# EAGLE design Project_PCB (EAGLE 9.6.2)
AUTHOR: Dunn, Frabosilio, Lee; BOARD_NAME: Satellite Platform Schematic; PROJECT_NAME: ME 507 Project
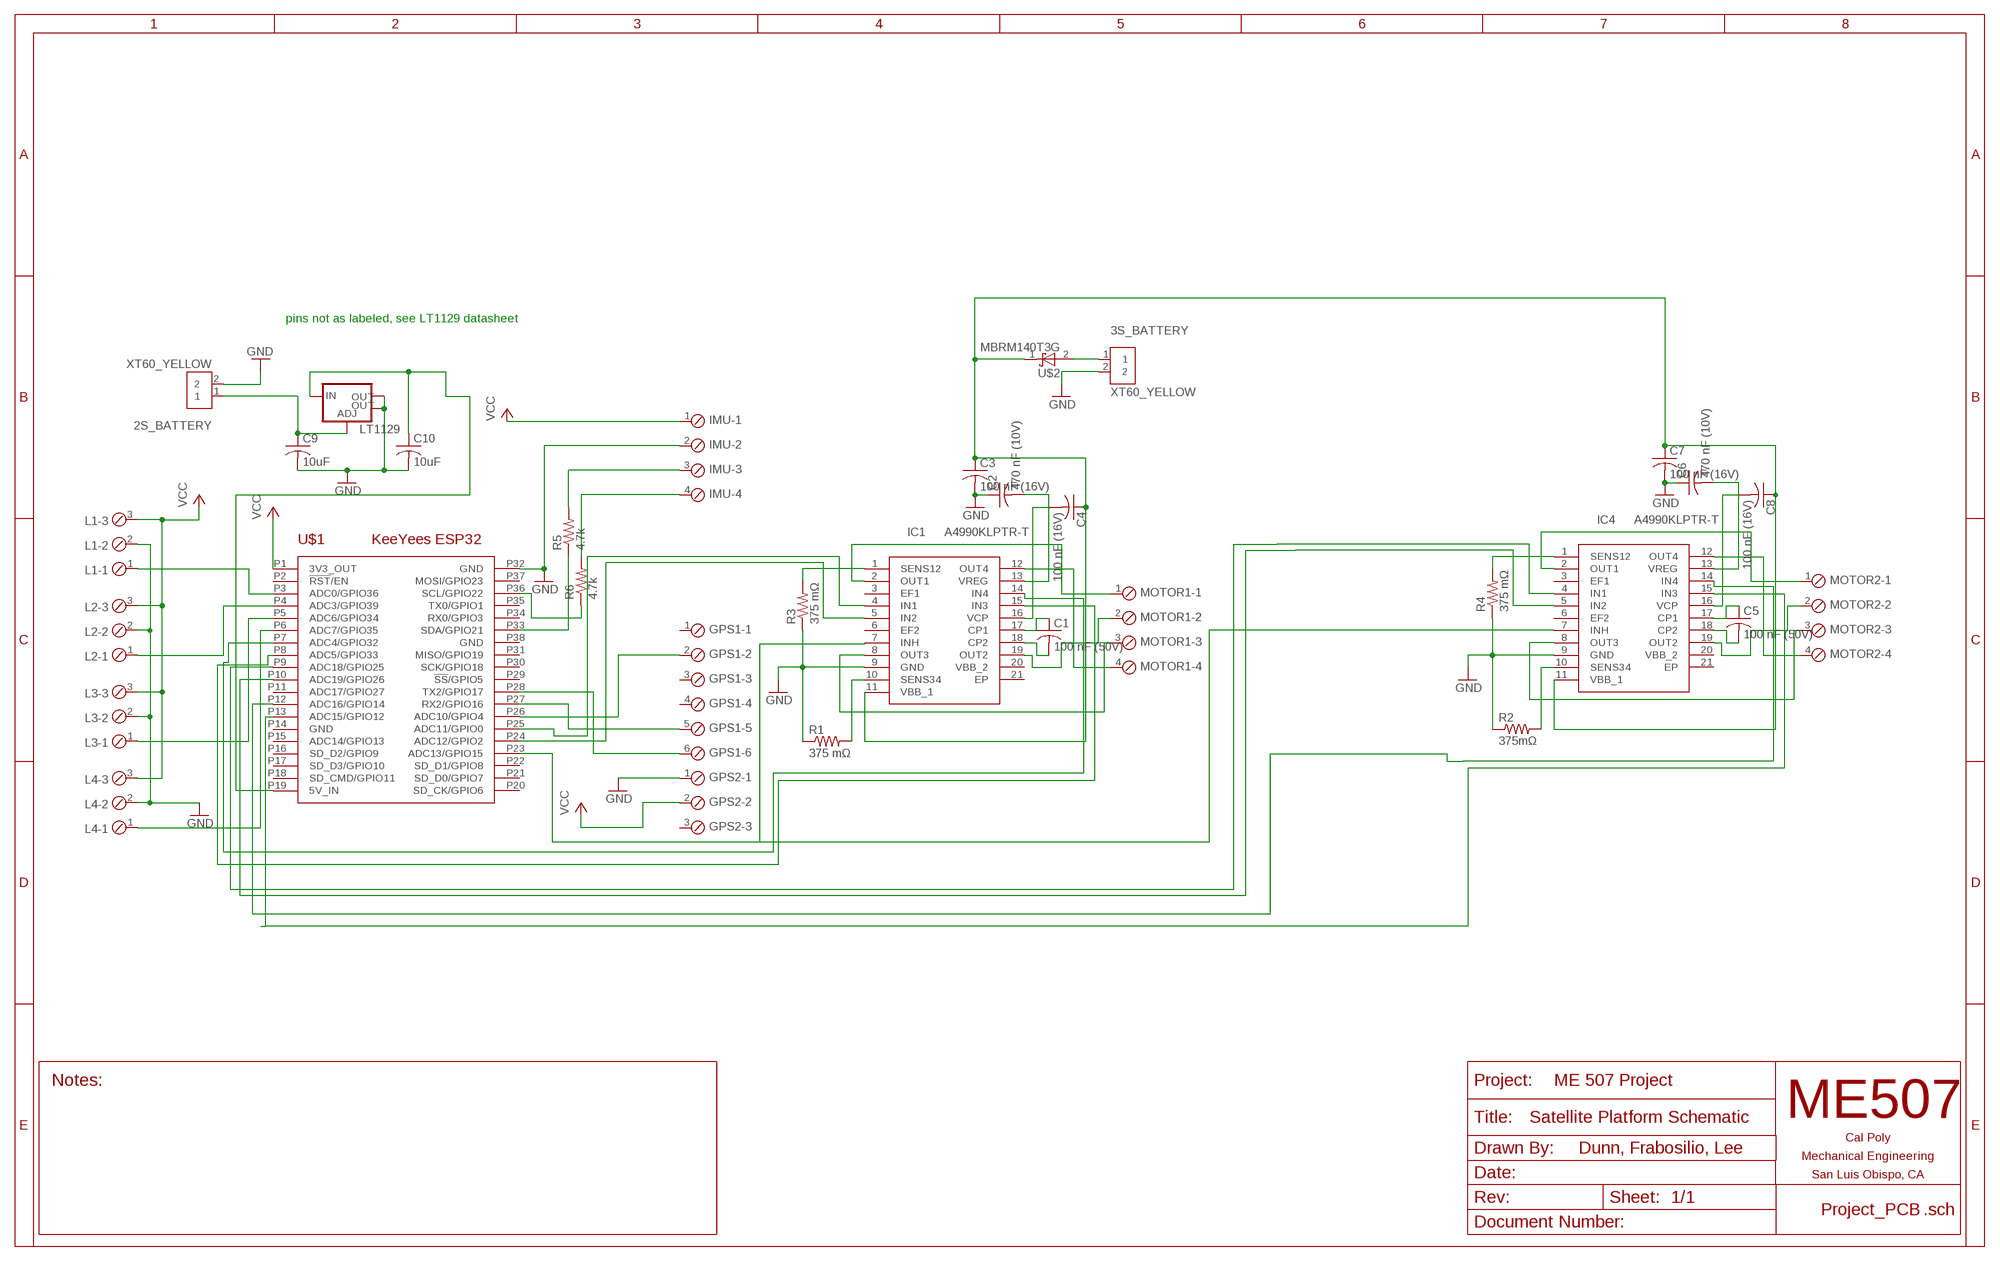
[diagram p0: schematic, sheet 1]

## Parts
2S_BATTERY  XT60_YELLOW  [AMASS_XT60PB-M]
3S_BATTERY  XT60_YELLOW  [AMASS_XT60PB-M]
C1  100 nF (50V)  C-USC0805  [C0805]
C2  470 nF (10V)  C-USC0805  [C0805]
C3  100 nF (16V)  C-USC0805  [C0805]
C4  100 nF (16V)  C-USC0805  [C0805]
C5  100 nF (50V)  C-USC0805  [C0805]
C6  470 nF (10V)  C-USC0805  [C0805]
C7  100 nF (16V)  C-USC0805  [C0805]
C8  100 nF (16V)  C-USC0805  [C0805]
C9  10uF  C-USC0805  [C0805]
C10  10uF  C-USC0805  [C0805]
GPS1  SCREWTERM_6P_254  [6POL254]
GPS2  SCREWTERM_3P_254  [3POL254]
IC1  A4990KLPTR-T  [A4405KLPTRT]
IC4  A4990KLPTR-T  [A4405KLPTRT]
IMU  SCREWTERM_6P_254  [6POL254]
L1  SCREWTERM_3P_254  [3POL254]
L2  SCREWTERM_3P_254  [3POL254]
L3  SCREWTERM_3P_254  [3POL254]
L4  SCREWTERM_3P_254  [3POL254]
LT1129  V_REG_LM1117SOT223  [SOT223]
MOTOR1  SCREWTERM_4P_254  [4POL254]
MOTOR2  SCREWTERM_4P_254  [4POL254]
R1  375 mΩ  R-US_R0805  [R0805]
R2  375mΩ  R-US_R0805  [R0805]
R3  375 mΩ  R-US_R0805  [R0805]
R4  375 mΩ  R-US_R0805  [R0805]
R5  4.7k  R-US_R0805  [R0805]
R6  4.7k  R-US_R0805  [R0805]
U$1  KEEYEES_ESP32  [KEEYEES_ESP32]
U$2  MBRM140T3G  [DIO_MBRM110LT1G]

## Nets
GND: 2S_BATTERY.2 3S_BATTERY.2 C2.1 C3.2 C6.1 C7.2 C9.2 C10.2 GPS2.1 IC1.9(GND) IC4.9(GND) IMU.2 L1.2 L2.2 L3.2 L4.2 LT1129.2(OUT) LT1129.4(OUT) R1.1 R2.1 R3.1 R4.1 U$1.P32(GND)
N$1: C10.1 LT1129.3(IN) U$1.P19(5V_IN)
N$2: GPS1.6 U$1.P28(TX2/GPIO17)
N$3: 3S_BATTERY.1 U$2.2(A)
N$4: L1.1 U$1.P3(ADC0/GPIO36)
N$5: GPS1.2 U$1.P26(ADC10/GPIO4)
N$6: GPS1.5 U$1.P27(RX2/GPIO16)
N$7: L2.1 U$1.P4(ADC3/GPIO39)
N$8: L3.1 U$1.P5(ADC6/GPIO34)
N$9: L4.1 U$1.P6(ADC7/GPIO35)
N$10: IMU.3 R5.2
N$11: IMU.4 R6.2
N$12: C1.1 IC1.17(CP1)
N$13: C1.2 IC1.18(CP2)
N$14: IC1.12(OUT4) MOTOR1.4
N$15: IC1.2(OUT1) MOTOR1.1
N$16: IC1.19(OUT2) MOTOR1.2
N$17: IC1.8(OUT3) MOTOR1.3
N$18: C4.2 IC1.16(VCP)
N$19: IC1.10(SENS34) R1.2
N$20: IC1.1(SENS12) R3.2
N$21: C3.1 C4.1 C7.1 C8.1 IC1.11(VBB_1) IC4.11(VBB_1) U$2.1(C)
N$22: C2.2 IC1.13(VREG)
N$23: IC1.4(IN1) U$1.P25(ADC11/GPIO0)
N$24: IC1.5(IN2) U$1.P24(ADC12/GPIO2)
N$25: IC1.7(INH) IC4.7(INH) U$1.P23(ADC13/GPIO15)
N$26: IC1.14(IN4) U$1.P7(ADC4/GPIO32)
N$27: IC1.15(IN3) U$1.P8(ADC5/GPIO33)
N$28: C5.1 IC4.17(CP1)
N$29: C5.2 IC4.18(CP2)
N$30: IC4.12(OUT4) MOTOR2.4
N$31: IC4.2(OUT1) MOTOR2.1
N$32: IC4.19(OUT2) MOTOR2.2
N$33: IC4.8(OUT3) MOTOR2.3
N$34: IC4.10(SENS34) R2.2
N$35: IC4.1(SENS12) R4.2
N$36: R6.1 U$1.P36(SCL/GPIO22)
N$37: C8.2 IC4.16(VCP)
N$38: C6.2 IC4.13(VREG)
N$39: IC4.4(IN1) U$1.P9(ADC18/GPIO25)
N$40: IC4.5(IN2) U$1.P10(ADC19/GPIO26)
N$41: R5.1 U$1.P33(SDA/GPIO21)
N$42: IC4.14(IN4) U$1.P12(ADC16/GPIO14)
N$43: IC4.15(IN3) U$1.P13(ADC15/GPIO12)
N$46: 2S_BATTERY.1 C9.1 LT1129.1(ADJ)
VCC: GPS2.2 IMU.1 L1.3 L2.3 L3.3 L4.3 U$1.P1(3V3_OUT)
Unconnected: GPS1.1 GPS1.3 GPS1.4 GPS2.3 IC1.3(EF1) IC1.6(EF2) IC1.20(VBB_2) IC1.21(EP) IC4.3(EF1) IC4.6(EF2) IC4.20(VBB_2) IC4.21(EP) IMU.5 IMU.6 U$1.P2(!RST!/EN) U$1.P11(ADC17/GPIO27) U$1.P15(ADC14/GPIO13) U$1.P16(SD_D2/GPIO9) U$1.P17(SD_D3/GPIO10) U$1.P18(SD_CMD/GPIO11) U$1.P20(SD_CK/GPIO6) U$1.P21(SD_D0/GPIO7) U$1.P22(SD_D1/GPIO8) U$1.P29(!SS!/GPIO5) U$1.P30(SCK/GPIO18) U$1.P31(MISO/GPIO19) U$1.P34(RX0/GPIO3) U$1.P35(TX0/GPIO1) U$1.P37(MOSI/GPIO23)

## Notes on the sheet
- pins not as labeled, see LT1129 datasheet

## Power pins joined to a net without a drawn wire
GND: U$1.P14(GND) U$1.P38(GND)

## Library data of the parts
2S_BATTERY 3S_BATTERY = XT60_YELLOW:XT60_YELLOW: Connector 2 pins Check availability <https://pricing.snapeda.com/parts/XT60%20YELLOW/Pololu/view-part?ref=eda>; AVAILABILITY: Not in stock; DESCRIPTION: Power connector; 65A; PIN: 2; Colour: yellow; MF: Pololu; MP: XT60 YELLOW; PACKAGE: None; PRICE: None
C1-C10 = rcl:C-US: CAPACITOR, American symbol; SPICEPREFIX: C
GPS1 IMU = ME507:SCREWTERM_6P: Screw Terminal Block This part is designed for a screw terminal connector. The 2.54mm (0.100 inch) foorprint can also be used for male or female pin headers such as those on most development boards. One can also solder wires directly into the holes, though this makes modifications or repairs to the system more inconvenient. Larger versions can carry more current.
GPS2 L1-L4 = ME507:SCREWTERM_3P: Screw Terminal Block This part is designed for a screw terminal connector. The 2.54mm (0.100 inch) foorprint can also be used for male or female pin headers such as those on most development boards. One can also solder wires directly into the holes, though this makes modifications or repairs to the system more inconvenient. Larger versions can carry more current.
IC1 IC4 = A4990KLPTR-T:A4990KLPTR-T: Automotive Dual Full Bridge Driver Source: Datasheet <https://www.allegromicro.com/-/media/files/datasheets/a4990-datasheet.ashx>; DESCRIPTION: Automotive Dual Full Bridge Driver; HEIGHT: 1.2mm; MANUFACTURER_NAME: Allegro Microsystems; MANUFACTURER_PART_NUMBER: A4990KLPTR-T; MOUSER_PART_NUMBER: 250-A4990KLPTR-T; MOUSER_PRICE-STOCK: https://www.mouser.co.uk/ProductDetail/Allegro-MicroSystems/A4990KLPTR-T?qs=pUKx8fyJudBvPkb0yTRqNQ%3D%3D
LT1129 = SparkFun-IC-Power:V_REG_LM1117: Voltage Regulator LM1117 Standard adjustable voltage regulator but in SMD form. Spark Fun Electronics SKU : COM-00595; PROD_ID: VREG-08170
MOTOR1 MOTOR2 = ME507:SCREWTERM_4P: Screw Terminal Block This part is designed for a screw terminal connector. The 2.54mm (0.100 inch) foorprint can also be used for male or female pin headers such as those on most development boards. One can also solder wires directly into the holes, though this makes modifications or repairs to the system more inconvenient. Larger versions can carry more current.
R1-R6 = rcl:R-US_: RESISTOR, American symbol; SPICEPREFIX: R
U$1 = ME507:KEEYEES_ESP32: Footprint for an add-on board (shield, hat, etc.) for a KeeYees ESP32 development board with ESP-WROOM-32 module. 38 pins.
U$2 = MBRM140T3G:MBRM140T3G: Check availability <https://pricing.snapeda.com/parts/MBRM140T3G/ON%20Semiconductor/view-part?ref=eda>; AVAILABILITY: In Stock; DESCRIPTION: Diode Schottky 40 V 1A Surface Mount Powermite; MF: ON Semiconductor; MP: MBRM140T3G; PACKAGE: POWERMITE-2 ON Semiconductor; PRICE: None; PURCHASE-URL: https://pricing.snapeda.com/search/part/MBRM140T3G/?ref=eda

## Net classes
2 lowpower: width 0.305 mm, drill 0.483 mm

## Board
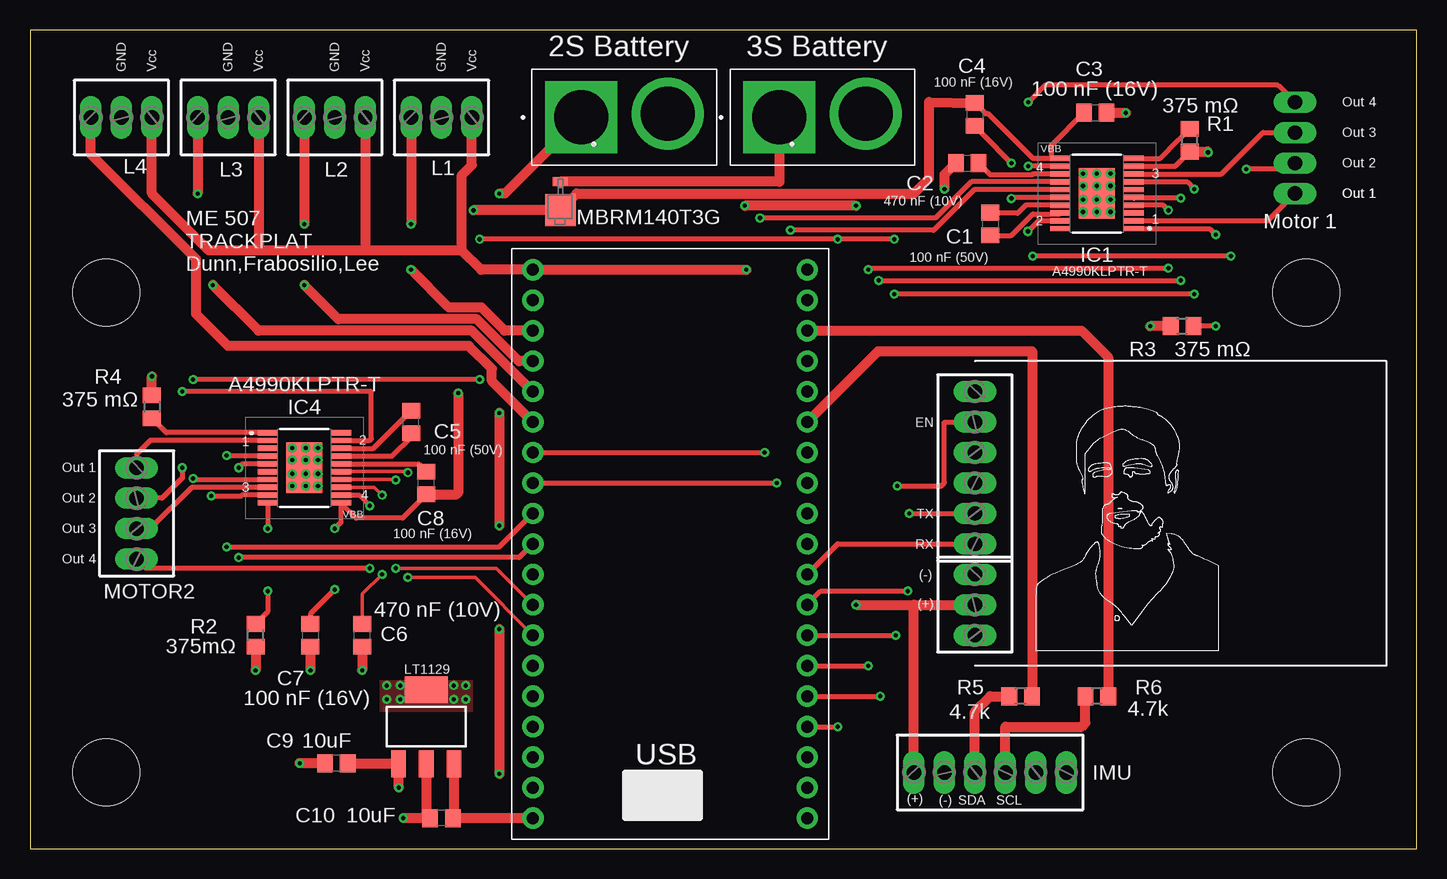
[diagram p1: board, top side]
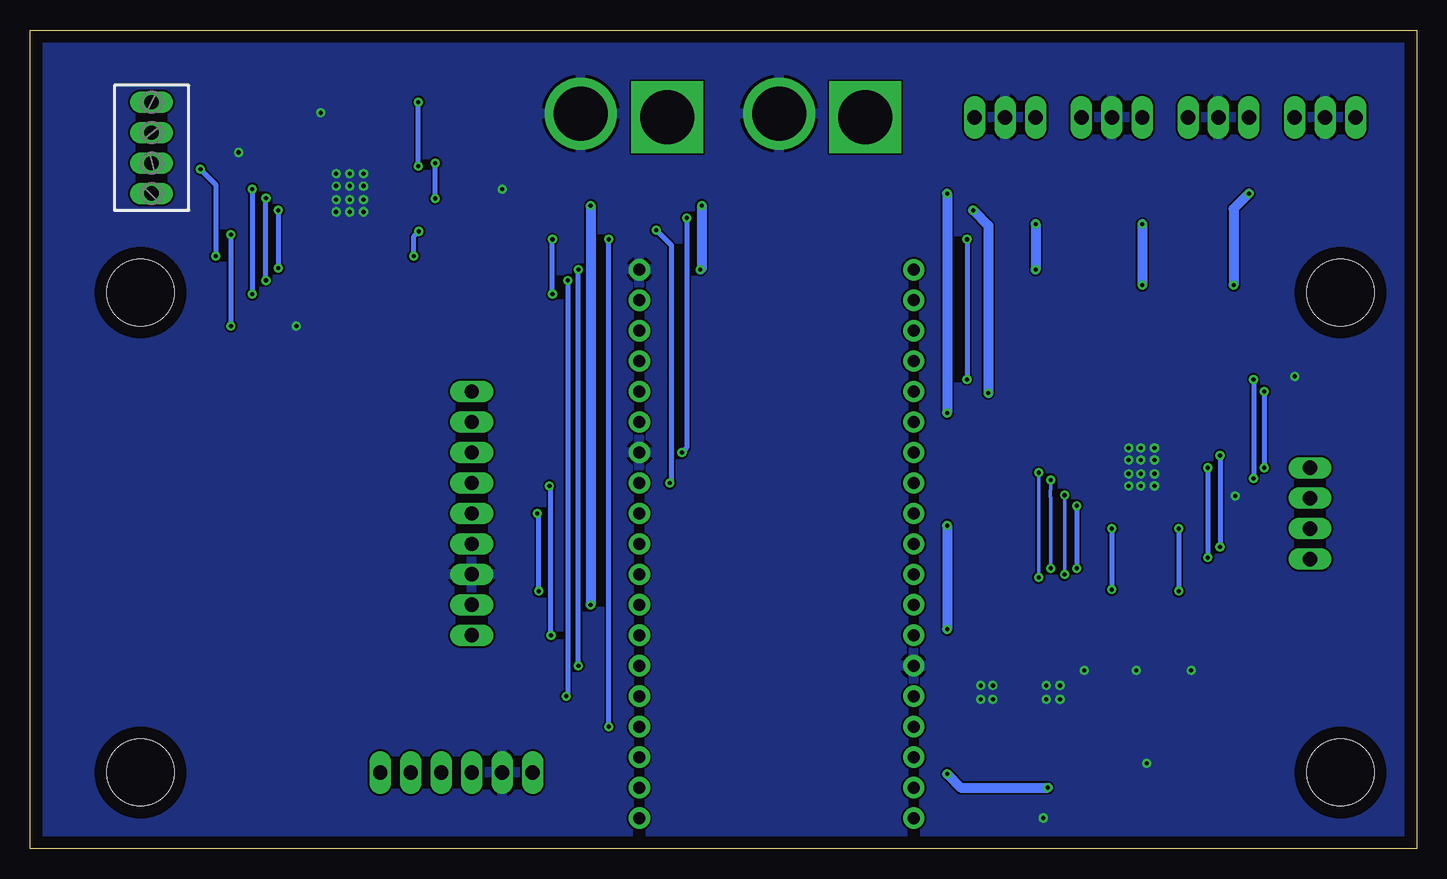
[diagram p2: board, bottom side, seen from below]

Size 115.55 x 68.25 mm. Coordinates in mm from the lower left corner, seen from the top.
Outline: 0,0 115.55,0 115.55,68.25 0,68.25 0,0
Copper layers (1*16): Top 0.035mm / dielectric 1.5mm / Bottom 0.035mm
Design rules "default": minimum track width 6mil, minimum drill 0.35mm, track to track 6mil, track to pad 6mil, pad to pad 6mil, via to via 6mil, smd to smd 6mil, copper to edge 40mil, drill to drill 6mil, minimum pad ring 10mil, minimum via ring 8mil, stop-mask expansion 4mil, vias tented up to drill 0mil, thermal gap 10mil
Holes 5.59 mm at 6.35,6.35 6.35,46.35 106.35,6.35 106.35,46.35

### Footprints (pad centres in the part's own frame; a part is rotated, then mirrored left to right if it is on the bottom)
AMASS_XT60PB-M = drill 4.5 pad 6 square: 1 -3.6,0 | drill 4.5 pad 6: 2 3.6,0.305
C0805 = smd 1.3 x 1.5: 1 -0.95,0; 2 0.95,0
6POL254 = drill 1.2 pad 1.778 long: 1 -6.35,0; 2 -3.81,0; 3 -1.27,0; 4 1.27,0; 5 3.81,0; 6 6.35,0
3POL254 = drill 1.2 long: 1 -2.54,0; 2 0,0; 3 2.54,0
A4405KLPTRT = smd 1.7 x 0.45: 1 -3.05,2.925; 2 -3.05,2.275; 3 -3.05,1.625; 4 -3.05,0.975; 5 -3.05,0.325; 6 -3.05,-0.325; 7 -3.05,-0.975; 8 -3.05,-1.625; 9 -3.05,-2.275; 10 -3.05,-2.925; 11 3.05,-2.925; 12 3.05,-2.275; 13 3.05,-1.625; 14 3.05,-0.975; 15 3.05,-0.325; 16 3.05,0.325; 17 3.05,0.975; 18 3.05,1.625; 19 3.05,2.275; 20 3.05,2.925 | smd 3 x 4.2: 21 0,0
SOT223 = smd 1.219 x 2.235: 1 -2.311,-3.099; 2 0,-3.099; 3 2.311,-3.099 | smd 3.6 x 2.2: 4 0,3.099
4POL254 = drill 1.2 long: 1 -3.81,0; 2 -1.27,0; 3 1.27,0; 4 3.81,0
R0805 = smd 1.3 x 1.5: 1 -0.95,0; 2 0.95,0
KEEYEES_ESP32 = drill 1 pad 1.778: P1 -11.43,21.59; P2 -11.43,19.05; P3 -11.43,16.51; P4 -11.43,13.97; P5 -11.43,11.43; P6 -11.43,8.89; P7 -11.43,6.35; P8 -11.43,3.81; P9 -11.43,1.27; P10 -11.43,-1.27; P11 -11.43,-3.81; P12 -11.43,-6.35; P13 -11.43,-8.89; P14 -11.43,-11.43; P15 -11.43,-13.97; P16 -11.43,-16.51; P17 -11.43,-19.05; P18 -11.43,-21.59; P19 -11.43,-24.13; P20 11.43,-24.13; P21 11.43,-21.59; P22 11.43,-19.05; P23 11.43,-16.51; P24 11.43,-13.97; P25 11.43,-11.43; P26 11.43,-8.89; P27 11.43,-6.35; P28 11.43,-3.81; P29 11.43,-1.27; P30 11.43,1.27; P31 11.43,3.81; P32 11.43,6.35; P33 11.43,8.89; P34 11.43,11.43; P35 11.43,13.97; P36 11.43,16.51; P37 11.43,19.05; P38 11.43,21.59
DIO_MBRM110LT1G = smd 2.67 x 2.54: 1 -1.235,0 | smd 0.762 x 1.27: 2 1.116,0

### Placement (x,y rotation side)
2S_BATTERY  49.53,60.96 0 top
3S_BATTERY  66.04,60.96 0 top
C1  80.01,52.07 270 top
C2  78.11,57.15 0 top
C3  88.77,61.34 0 top
C4  78.74,61.21 270 top
C5  31.75,35.56 90 top
C6  27.69,17.78 90 top
C7  23.37,17.78 270 top
C8  33.02,30.48 90 top
C9  25.53,7.11 180 top
C10  34.29,2.54 180 top
GPS1  78.74,31.75 270 top
GPS2  78.74,20.32 270 top
IC1  88.9,54.61 180 top
IC4  22.86,31.75 0 top
IMU  80.01,6.35 0 top
L1  34.29,60.96 0 top
L2  25.4,60.96 0 top
L3  16.51,60.96 0 top
L4  7.62,60.96 0 top
LT1129  33.02,10.16 0 top
MOTOR1  105.41,58.42 90 bottom
MOTOR2  8.89,27.94 270 top
R1  96.65,59.05 90 top
R2  18.8,17.78 90 top
R3  96.01,43.56 0 top
R4  10.16,36.83 270 top
R5  82.55,12.7 180 top
R6  88.9,12.7 180 top
U$1  53.34,26.67 0 top
U$2  44.2,54.48 90 top

### Tracks (layer width: path | path; a pad name or v marks a point on that pad's centre or on a via)
GND  (via drill 0.35)
  Top 0.406: v15.11,29.39 17.58,29.39 17.66,29.48 IC4.9 | IC1.9 95.43,56.88 R1.1
  Top 0.813: C9.2 v22.48,7.11 | v31.11,2.54 C10.2 33.02,2.86 LT1129.2 | R4.1 v10.16,39.37 | R2.1 v18.8,14.86 | C7.2 v23.37,14.86 | C6.1 v27.69,14.86 | R3.1 v93.34,43.56 | R1.1 98.11,58.1 v98.17,58.04 | C2.1 76.2,56.2 v76.2,54.99 | C3.2 v91.31,61.34
  other vias: 21.84,33.4 22.99,33.4 24,33.4 24,32.38 22.99,32.38 21.84,32.38 21.84,31.24 22.99,31.24 24,31.24 24,30.23 22.99,30.23 21.84,30.23 87.76,56.26 87.76,55.24 87.76,54.1 87.76,53.09 88.9,53.09 90.04,53.09 90.04,54.1 90.04,56.26 90.04,55.24 88.9,56.26 88.9,55.24 88.9,54.1 29.72,13.59 29.72,12.45 30.86,12.45 30.86,13.59 36.32,13.59 35.31,13.59 35.31,12.45 36.32,12.45
  pour Bottom (rank 5): -3.81,71.12 119.38,71.12 119.38,-2.54 -3.81,-2.54
  pour Top (no thermals): 29.21,13.97 36.83,13.97 36.83,11.43 29.21,11.43
N$1
  Top 0.813: U$1.P19 C10.1 35.33,2.63 LT1129.3
N$2
  Top 0.406: U$1.P28 67.31,25.4 GPS1.6
N$3
  Top 0.813: U$2.2 62.44,55.6 3S_BATTERY.1
N$4  (via drill 0.35)
  Top 0.813: U$1.P3 39.56,43.18 37.63,45.11 34.9,45.11 v31.75,48.26 | L1.1 v31.75,52.07
  Bottom 0.813: v31.75,52.07 v31.75,48.26
N$5  (via drill 0.35)
  Top 0.406: U$1.P26 v72.14,17.78 | v72.26,30.23 75.95,30.23 76.2,30.48 76.2,35.56 GPS1.2
  Bottom 0.406: v72.14,17.78 72.14,30.1 v72.26,30.23
N$6  (via drill 0.35)
  Top 0.406: U$1.P27 65.91,21.46 v73.15,21.46 | v73.28,27.94 GPS1.5
  Bottom 0.406: v73.15,21.46 73.15,27.81 v73.28,27.94
N$7  (via drill 0.35)
  Top 0.813: U$1.P4 40.73,40.64 37.23,44.15 25.7,44.15 v22.86,46.99 | L2.1 v22.86,52.07
  Bottom 0.813: v22.86,52.07 v22.86,46.99
N$8  (via drill 0.35)
  Top 0.813: U$1.P5 36.83,43.18 19.05,43.18 v15.24,46.99 | L3.1 v13.97,54.61
  Bottom 0.813: v13.97,54.61 15.24,53.34 v15.24,46.99
N$9
  Top 0.813: U$1.P6 38.48,38.99 38.48,40.01 36.58,41.91 16.51,41.91 13.84,44.58 13.84,49.15 5.08,57.91 L4.1
N$10
  Top 0.813: IMU.3 78.74,11.43 80.01,12.7 R5.2
N$11
  Top 0.813: IMU.4 81.28,10.16 87.63,10.16 87.95,10.48 R6.2
N$12
  Top 0.406: IC1.17 82.97,53.63 82.3,52.96 80.07,52.96 C1.1
N$13
  Top 0.406: IC1.18 85.78,52.92 83.58,52.92 81.79,51.12 C1.2
N$14  (via drill 0.35)
  Top 0.406: IC1.12 83.2,56.88 v83.19,56.9 | MOTOR1.4 104.01,63.63 84.58,63.63 v83.19,62.23
  Bottom 0.406: v83.19,56.9 v83.19,62.23
N$15
  Top 0.406: IC1.2 103.14,52.34 MOTOR1.1
N$16  (via drill 0.35)
  Top 0.406: MOTOR1.2 104.9,56.64 v101.35,56.64 | v100.08,49.4 v83.57,49.4 | IC1.19 85.84,52.32 84.03,52.32 v83.16,51.46
  Bottom 0.406: v101.35,56.64 100.08,55.37 v100.08,49.4 | v83.57,49.4 83.57,51.05 v83.16,51.46
N$17
  Top 0.406: IC1.8 99.29,56.23 102.74,59.69 MOTOR1.3
N$18  (via drill 0.35)
  Top 0.406: IC1.16 81.87,54.28 v81.79,54.2 | v81.79,57.15 79.44,59.5 C4.2
  Bottom 0.406: v81.79,54.2 v81.79,57.15
N$19
  Top 0.406: R1.2 95.75,59.11 94.17,57.53 IC1.10
N$20  (via drill 0.35)
  Top 0.406: IC1.1 98.3,51.69 v98.81,51.18 | v98.81,43.56 R3.2
  Bottom 0.406: v98.81,51.18 v98.81,43.56
N$21  (via drill 0.35)
  Top 0.406: C8.1 31.05,27.56 27.18,27.56 IC4.11 25.91,27.18 v25.4,26.67 | v25.4,21.59 23.37,19.56 C7.1 | IC1.11 85.09,57.53 | 85.09,57.53 83.58,57.53 79.85,61.27 79.63,61.27 C4.1 | C3.1 85.09,58.61 85.09,57.53
  Top 0.813: v36.96,53.21 36.99,53.25 U$2.1 45.56,54.61 73.66,54.61 74.93,55.88 74.93,62.23 C4.1 | C8.1 35.56,29.53 35.69,29.66 v35.69,37.97
  Bottom 0.406: v25.4,26.67 v25.4,21.59
  Bottom 0.813: v36.96,53.21 35.69,51.94 v35.69,37.97
N$22
  Top 0.406: IC1.13 83.56,56.23 83.49,56.16 80.04,56.16 C2.2
N$23  (via drill 0.35)
  Top 0.406: U$1.P25 v69.85,15.24 | IC1.4 94.45,53.63 v94.87,53.21 | v69.85,48.26 69.98,48.39 v94.87,48.39
  Bottom 0.406: v69.85,15.24 v69.85,48.26 | v94.87,53.21 v94.87,48.39
N$24  (via drill 0.35)
  Top 0.406: U$1.P24 v70.87,12.7 | v70.74,47.37 v95.89,47.37 | v95.89,54.23 92.01,54.23 IC1.5
  Bottom 0.406: v70.74,47.37 70.74,12.83 v70.87,12.7 | v95.89,47.37 v95.89,54.23
N$25  (via drill 0.35)
  Top 0.406: U$1.P23 v67.31,10.16 | v37.47,50.8 v67.31,50.8 v72.01,50.8 | v37.47,39.12 v13.59,39.12 | v13.59,30.86 13.68,30.77 IC4.7 | IC1.7 96.43,55.59 v97.03,54.99 | v97.03,46.23 v72.01,46.23
  Bottom 0.406: v67.31,10.16 v67.31,50.8 | v37.47,50.8 v37.47,39.12 | v13.59,39.12 v13.59,30.86 | v97.03,54.99 v97.03,46.23 | v72.01,46.23 v72.01,50.8
N$26  (via drill 0.35)
  Top 0.406: U$1.P7 v61.21,33.02 | IC1.14 78.44,55.59 75.44,52.58 v60.83,52.58
  Bottom 0.406: v60.83,52.58 60.83,33.4 v61.21,33.02
N$27  (via drill 0.35)
  Top 0.406: U$1.P8 v62.23,30.48 | IC1.15 78.68,54.94 75.31,51.56 v63.37,51.56
  Bottom 0.406: v62.23,30.48 62.1,30.61 62.1,50.29 v63.37,51.56
N$28
  Top 0.406: IC4.17 30.18,32.73 31.75,34.29 C5.1
N$29
  Top 0.406: C5.2 30.86,35.62 30.85,35.62 28.61,33.38 IC4.18
N$30  (via drill 0.35)
  Top 0.406: IC4.12 27.42,29.48 v28.32,28.57 | v28.32,23.37 9.65,23.37 MOTOR2.4
  Bottom 0.406: v28.32,28.57 v28.32,23.37
N$31
  Top 0.406: IC4.2 10.04,34.02 10.03,34.04 8.89,32.89 MOTOR2.1
N$32  (via drill 0.35)
  Top 0.406: IC4.19 28.31,34.02 28.45,34.16 28.45,38.1 v12.7,38.1 | MOTOR2.2 11.02,29.21 12.7,30.89 v12.7,31.75
  Bottom 0.406: v12.7,38.1 v12.7,31.75
N$33
  Top 0.406: IC4.8 13.49,30.12 10.03,26.67 MOTOR2.3
N$34  (via drill 0.35)
  Top 0.406: IC4.10 v19.81,26.67 | v19.81,21.46 19.81,19.75 R2.2
  Bottom 0.406: v19.81,26.67 v19.81,21.46
N$35
  Top 0.406: IC4.1 11.37,34.67 R4.2
N$36
  Top 0.813: U$1.P36 87.63,43.18 89.85,40.96 R6.1
N$37
  Top 0.406: IC4.16 32.38,32.08 C8.2
N$38  (via drill 0.35)
  Top 0.305: IC4.13 28.68,30.12 v29.34,29.46 | v29.34,22.86 27.69,21.21 C6.2
  Bottom 0.305: v29.34,29.46 v29.34,22.86
N$39  (via drill 0.35)
  Top 0.406: IC4.4 16.42,32.73 v16.38,32.77 | v16.38,25.15 39.12,25.15 U$1.P9
  Bottom 0.406: v16.38,32.77 v16.38,25.15
N$40  (via drill 0.35)
  Top 0.406: IC4.5 17.72,32.08 v17.4,31.75 | U$1.P10 40.77,24.26 v17.4,24.26
  Bottom 0.406: v17.4,31.75 v17.4,24.26
N$41
  Top 0.813: R5.1 83.5,41.47 70.68,41.47 U$1.P33
N$42  (via drill 0.35)
  Top 0.305: IC4.14 30.44,30.77 v30.48,30.73 | U$1.P12 38.86,23.37 v30.48,23.37
  Bottom 0.305: v30.48,30.73 30.48,29.92 30.53,29.87 30.53,29.31 30.48,29.26 v30.48,23.37
N$43  (via drill 0.35)
  Top 0.305: IC4.15 31.41,31.43 v31.5,31.34 | U$1.P13 37.08,22.61 v31.5,22.61
  Bottom 0.305: v31.5,31.34 v31.5,22.61
N$46  (via drill 0.35)
  Top 0.813: v30.73,5.08 30.71,5.11 LT1129.1 30.66,7.11 C9.1 | 2S_BATTERY.1 39.58,54.61 v39.12,54.61 | v39.12,36.32 v39.12,26.92 | v39.12,18.29 v39.12,6.22
  Bottom 0.813: v39.12,6.22 37.97,5.08 v30.73,5.08 | v39.12,54.61 v39.12,36.32 | v39.12,26.92 v39.12,18.29
VCC  (via drill 0.35)
  Top 0.813: v59.69,48.26 U$1.P1 37.59,48.26 35.99,49.86 | v68.83,53.59 v59.56,53.59 | v68.83,20.32 73.66,20.32 | 73.66,20.32 GPS2.2 | L1.3 36.83,56.99 35.99,56.15 35.99,49.86 | 35.99,49.86 27.94,49.86 | 27.94,49.86 19.05,49.86 | 19.05,49.86 14.91,49.86 10.16,54.61 L4.3 | L3.3 19.05,49.86 | L2.3 27.94,49.86 | IMU.1 73.66,20.32
  Bottom 0.813: v59.56,53.59 59.56,48.39 v59.69,48.26 | v68.83,53.59 v68.83,20.32

### Text on the board
tNames: 2S Battery | 3S Battery | GND | Vcc | GND | Vcc | GND | Vcc | GND | Vcc | Out 4 | Out 3 | VBB | Out 2 | 4 | 3 | Out 1 | Out 1 | 2 | 1 | Motor 1 | ME 507 / TRACKPLAT / Dunn,Frabosilio,Lee | EN | 1 | 2 | Out 1 | 3 | Out 2 | 4 | VBB | TX | Out 3 | RX | Out 4 | (-) | (+) | USB | (+) | (-) | SDA | SCL